# Altium schematic sheet Relays.SchDoc
size A4
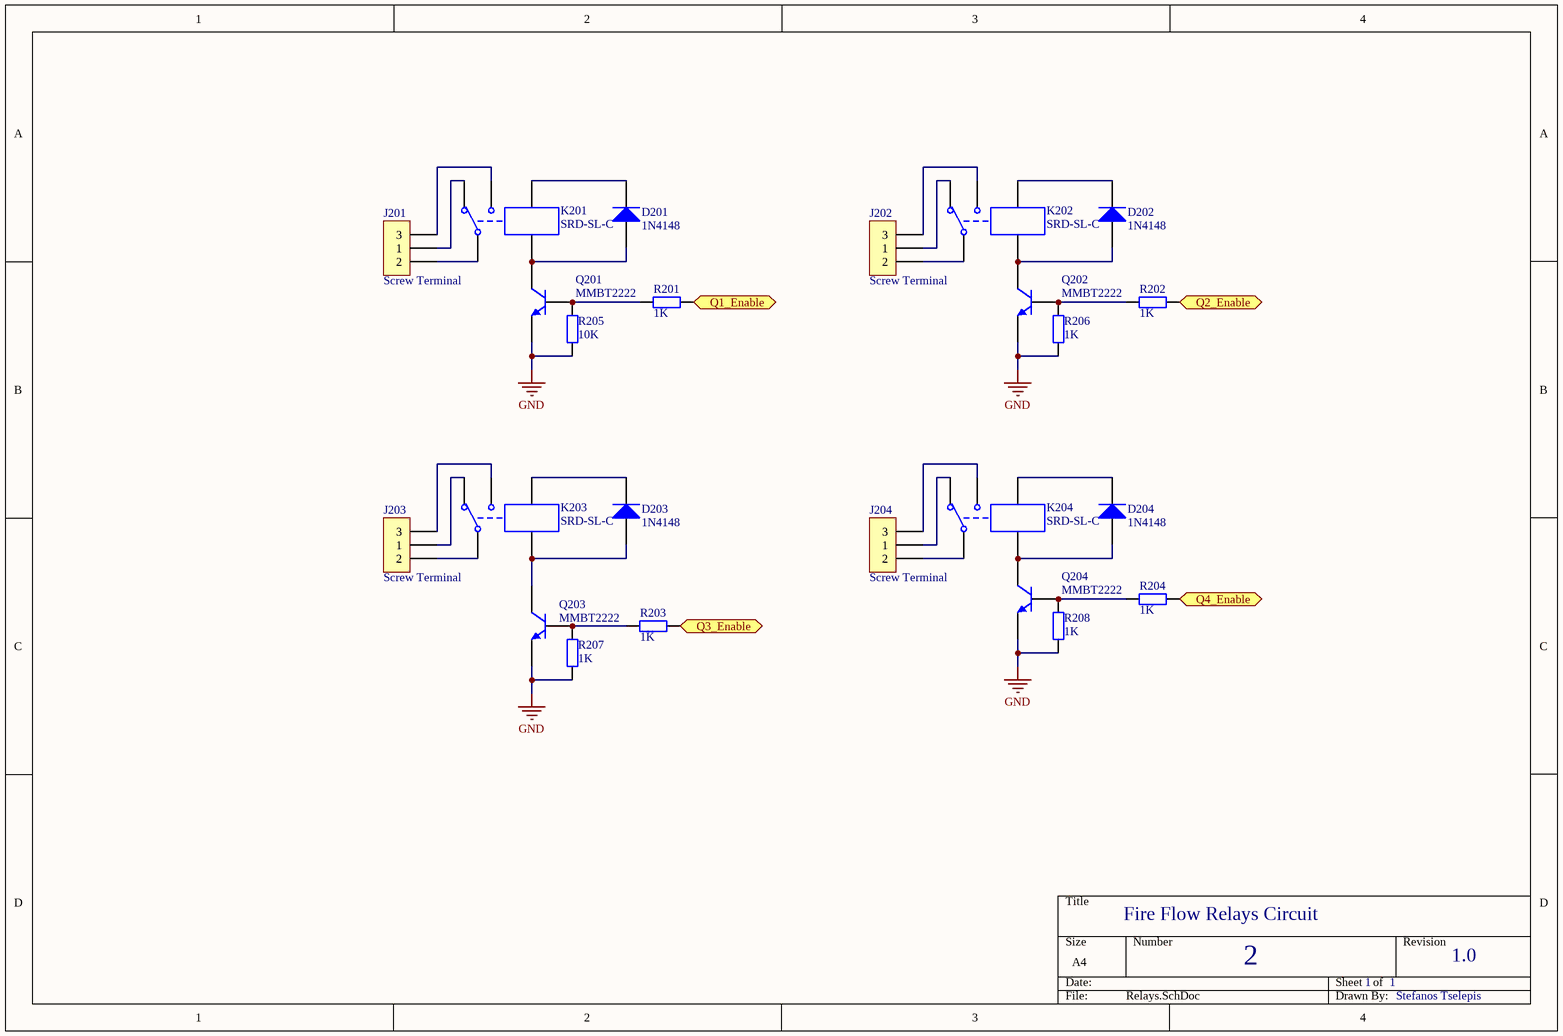
[diagram p0: Relays.SchDoc]

## Parts
D201  1N4148  [CD2012-0805]
D202  1N4148  [CD2012-0805]
D203  1N4148  [CD2012-0805]
D204  1N4148  [CD2012-0805]
J201  Screw Terminal  [3pin ST]
J202  Screw Terminal  [3pin ST]
J203  Screw Terminal  [3pin ST]
J204  Screw Terminal  [3pin ST]
K201  SRD-SL-C  [SRD-SL-C]
K202  SRD-SL-C  [SRD-SL-C]
K203  SRD-SL-C  [SRD-SL-C]
K204  SRD-SL-C  [SRD-SL-C]
Q201  MMBT2222  [SO-G3]
Q202  MMBT2222  [SO-G3]
Q203  MMBT2222  [SO-G3]
Q204  MMBT2222  [SO-G3]
R201  1K  [CR2012-0805]
R202  1K  [CR2012-0805]
R203  1K  [CR2012-0805]
R204  1K  [CR2012-0805]
R205  10K  [CR2012-0805]
R206  1K  [CR2012-0805]
R207  1K  [CR2012-0805]
R208  1K  [CR2012-0805]

## Ports
Q1_Enable (in), Q2_Enable (in), Q3_Enable (in), Q4_Enable (in)

## Nets
GND: Q201.2(E) Q202.2(E) Q203.2(E) Q204.2(E) R205.1 R206.1 R207.1 R208.1
Q1_Enable: R201.2 ; port Q1_Enable
Q2_Enable: R202.2 ; port Q2_Enable
Q3_Enable: R203.2 ; port Q3_Enable
Q4_Enable: R204.2 ; port Q4_Enable
NetD201_A: D201.A K201.2 Q201.3(C)
NetD201_K: D201.K K201.1
NetD202_A: D202.A K202.2 Q202.3(C)
NetD202_K: D202.K K202.1
NetD203_A: D203.A K203.2 Q203.3(C)
NetD203_K: D203.K K203.1
NetD204_A: D204.A K204.2 Q204.3(C)
NetD204_K: D204.K K204.1
NetJ201_1: J201.1 K201.5
NetJ201_2: J201.2 K201.3
NetJ201_3: J201.3 K201.4
NetJ202_1: J202.1 K202.5
NetJ202_2: J202.2 K202.3
NetJ202_3: J202.3 K202.4
NetJ203_1: J203.1 K203.5
NetJ203_2: J203.2 K203.3
NetJ203_3: J203.3 K203.4
NetJ204_1: J204.1 K204.5
NetJ204_2: J204.2 K204.3
NetJ204_3: J204.3 K204.4
NetQ201_1: Q201.1(B) R201.1 R205.2
NetQ202_1: Q202.1(B) R202.1 R206.2
NetQ203_1: Q203.1(B) R203.1 R207.2
NetQ204_1: Q204.1(B) R204.1 R208.2

## Notes on the sheet
- Fire Flow Relays Circuit
- 2
- 1
- 1.0
- Stefanos Tselepis

## Library data of the parts
D201-D204 = Diode: Value: 1N4148
J201-J204 = 3 pin Screw Terminal: WR-TBL Terminal block - serie 102 - 5.0mm; ComponentLink2 Description: Datasheet; NoPins: 3; ComponentLink2URL: http://katalog.we-online.de/em/datasheet/6911027100xx.pdf
K201-K204 = Relay SRD-SL-C
Q201-Q204 = MMBT2222: NPN General Purpose Amplifier; Value: MMBT2222
R201-R208 = Resistor
  R201-R204 R206-R208: Value: 1K
  R205: Value: 10K